# EasyEDA schematic ultrasonic motion sensor.json
TITLE: Sheet_1; REV: 1.0; Date: 2024-07-13; Sheet: 1/1; Company: Your Company
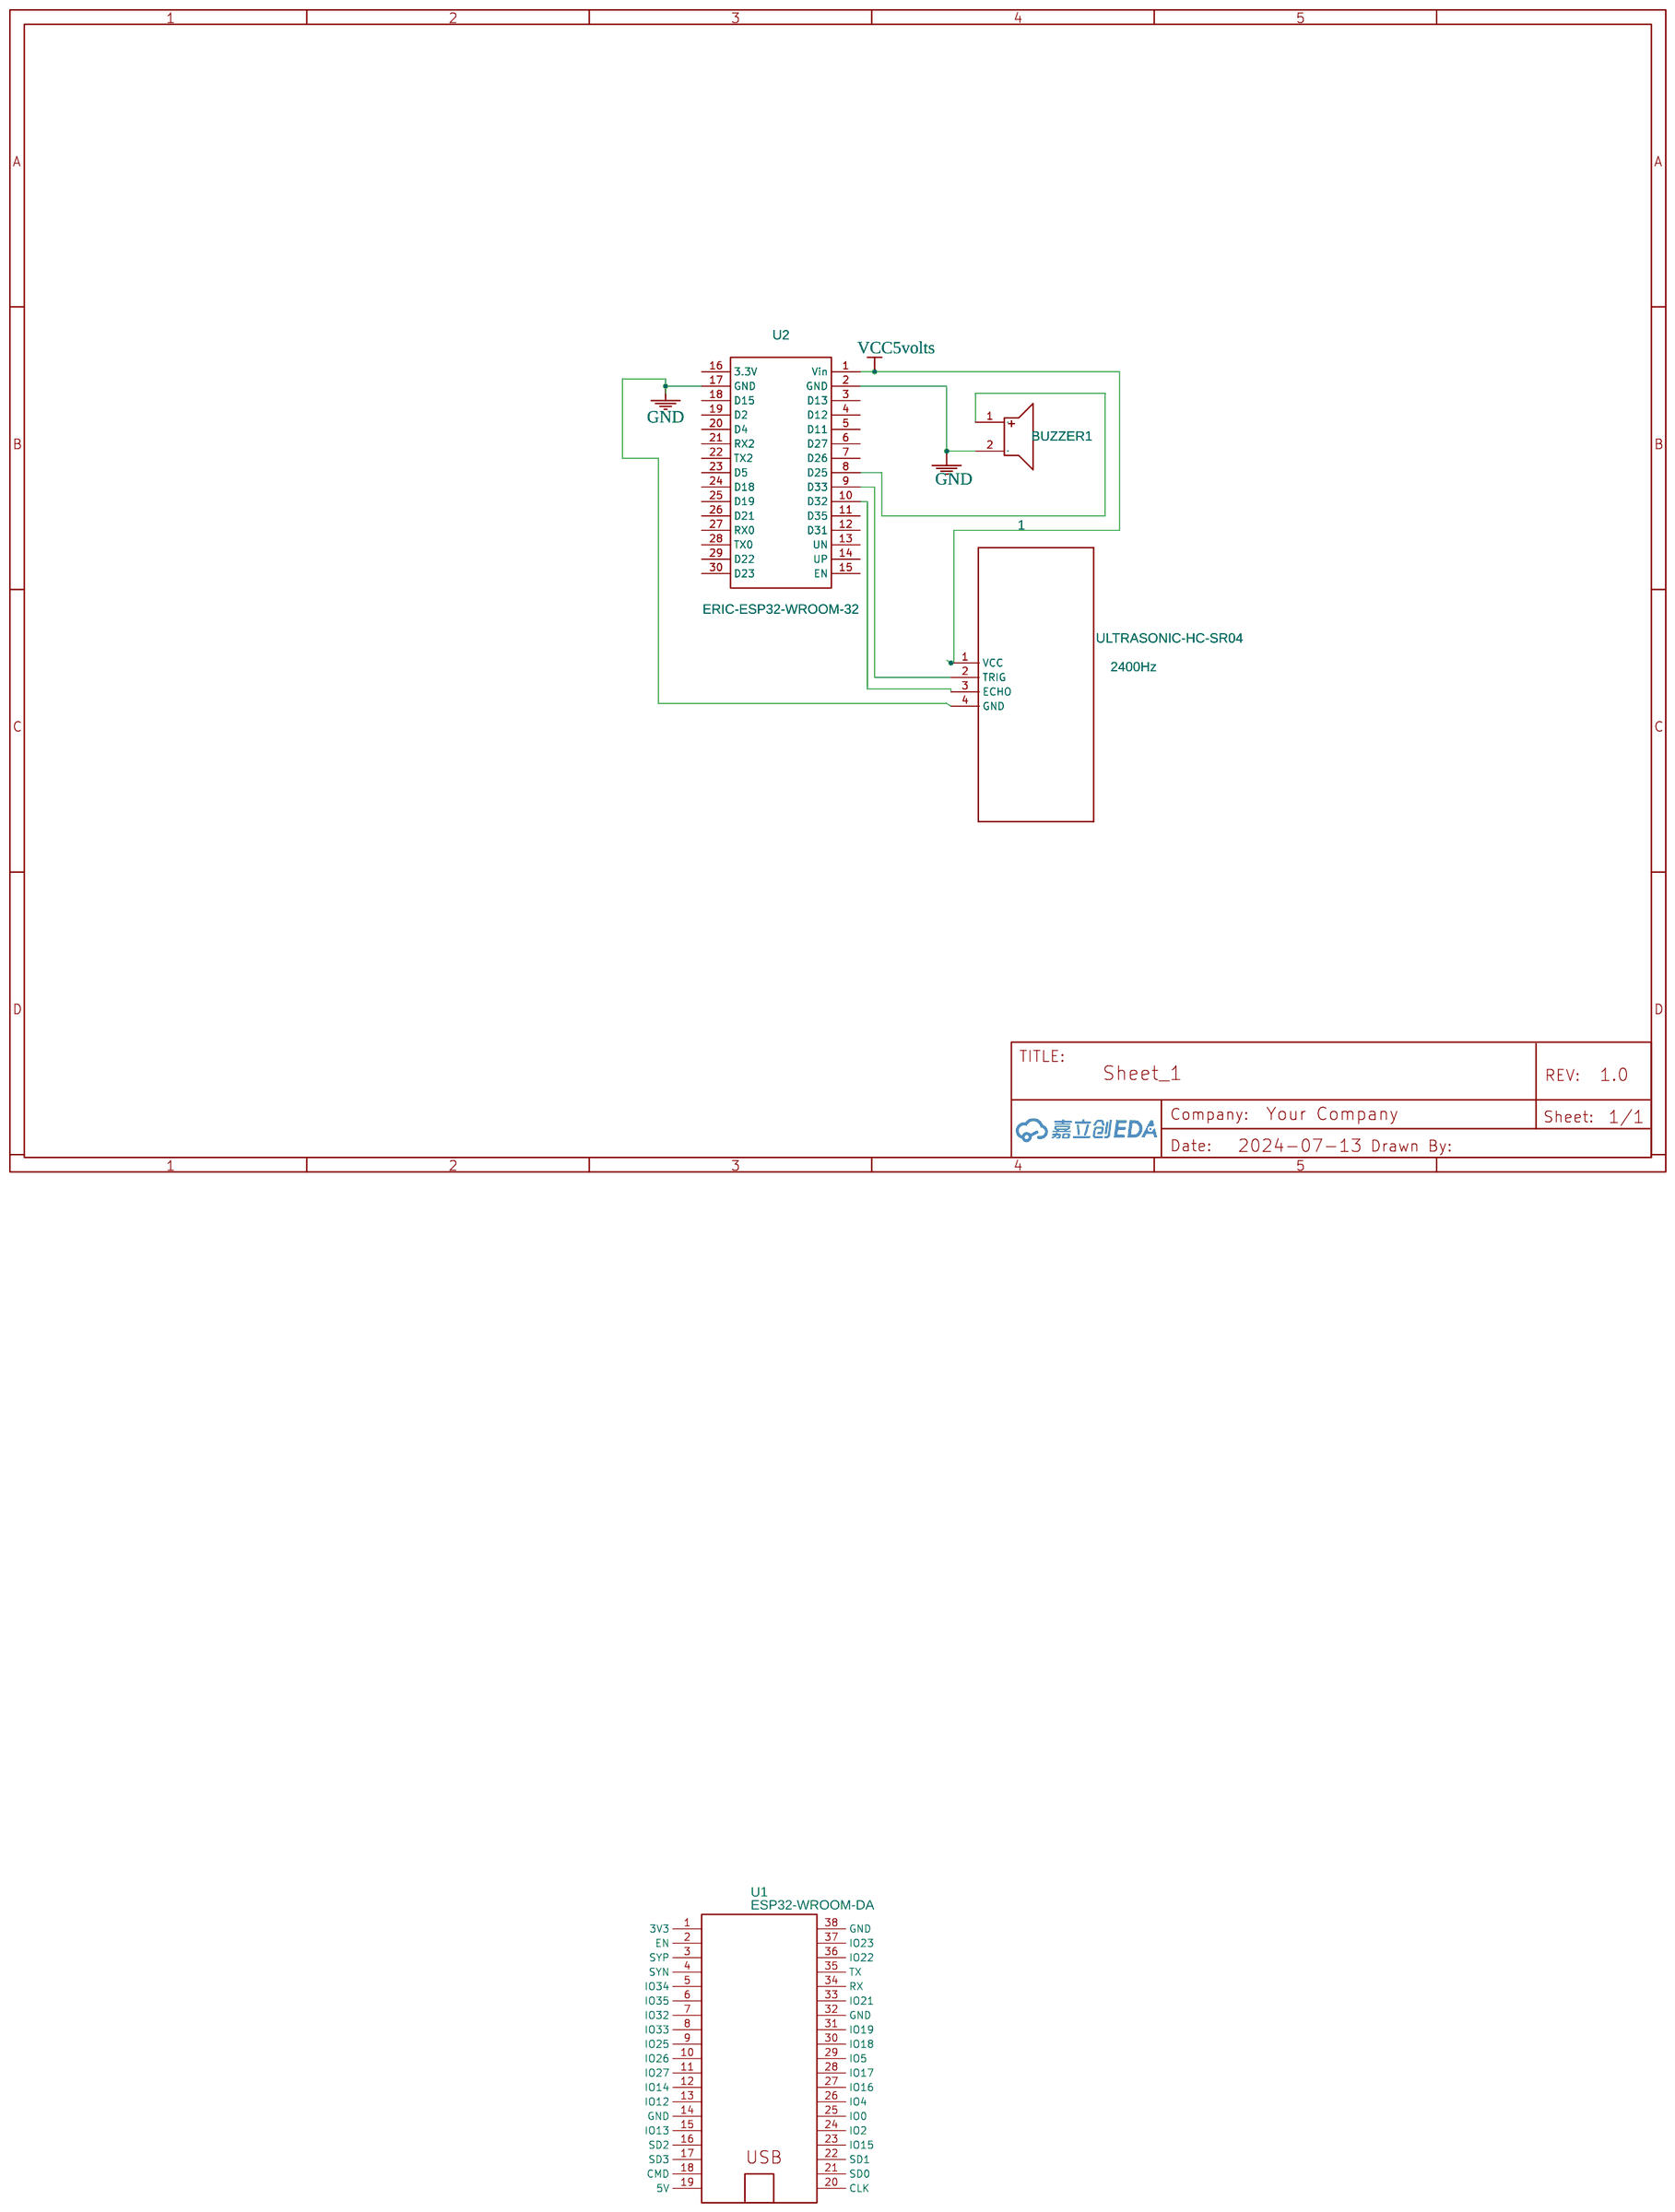
[diagram p0: schematic sheet]

## Parts
1  ULTRASONIC-HC-SR04  [ULTRASONIC-HC-SR04]
BUZZER1  2400Hz  [BUZ-TH_BD12.0-P7.60-D0.6-FD]
U1  ESP32-WROOM-DA  [ESP32-WROOM-DA]
U2  ERIC-ESP32-WROOM-32  [ESP32-WROOM-32]

## Library data of the parts
1 = ULTRASONIC-HC-SR04: Contributor: pawelze
BUZZER1 = TMB12A05_C781860: Contributor: LCSC; Supplier: LCSC; Supplier Part: C781860; Manufacturer: YUEXIN(悦馨); JLCPCB Part Class: Extended Part
U1 = ESP32-WROOM-DA: Manufacturer: Expressif; Supplier Part: ESP32; Contributor: mcmik3
U2 = ESP32-WROOM-32: Manufacturer: Espressif; Supplier: Espressif; link: https://www.espressif.com/sites/default/files/documentation/esp32_datasheet_en.pdf; Contributor: M.Talmiz ur Rehman

## Nets
GND: 1.4(GND) BUZZER1.2 U2.2(GND) U2.17(GND)
VCC5volts: 1.1(VCC) U2.1(Vin)
Net-(1-2): 1.2(TRIG) U2.9(D33)
Net-(1-3): 1.3(ECHO) U2.10(D32)
Net-(BUZZER1-1): BUZZER1.1 U2.8(D25)

Not connected (* = marked no-connect by the designer): U1 1(3V3) 2(EN) 3(SYP) 4(SYN) 5(IO34) 6(IO35) 7(IO32) 8(IO33) 9(IO25) 10(IO26) 11(IO27) 12(IO14) 13(IO12) 14(GND) 15(IO13) 16(SD2) 17(SD3) 18(CMD) 19(5V) 20(CLK) 21(SD0) 22(SD1) 23(IO15) 24(IO2) 25(IO0) 26(IO4) 27(IO16) 28(IO17) 29(IO5) 30(IO18) 31(IO19) 32(GND) 33(IO21) 34(RX) 35(TX) 36(IO22) 37(IO23) 38(GND); U2 3(D13) 4(D12) 5(D11) 6(D27) 7(D26) 11(D35) 12(D31) 13(UN) 14(UP) 15(EN) 16(3.3V) 18(D15) 19(D2) 20(D4) 21(RX2) 22(TX2) 23(D5) 24(D18) 25(D19) 26(D21) 27(RX0) 28(TX0) 29(D22) 30(D23)
